# EAGLE design ValveModule_r2 (EAGLE 7.7.0)
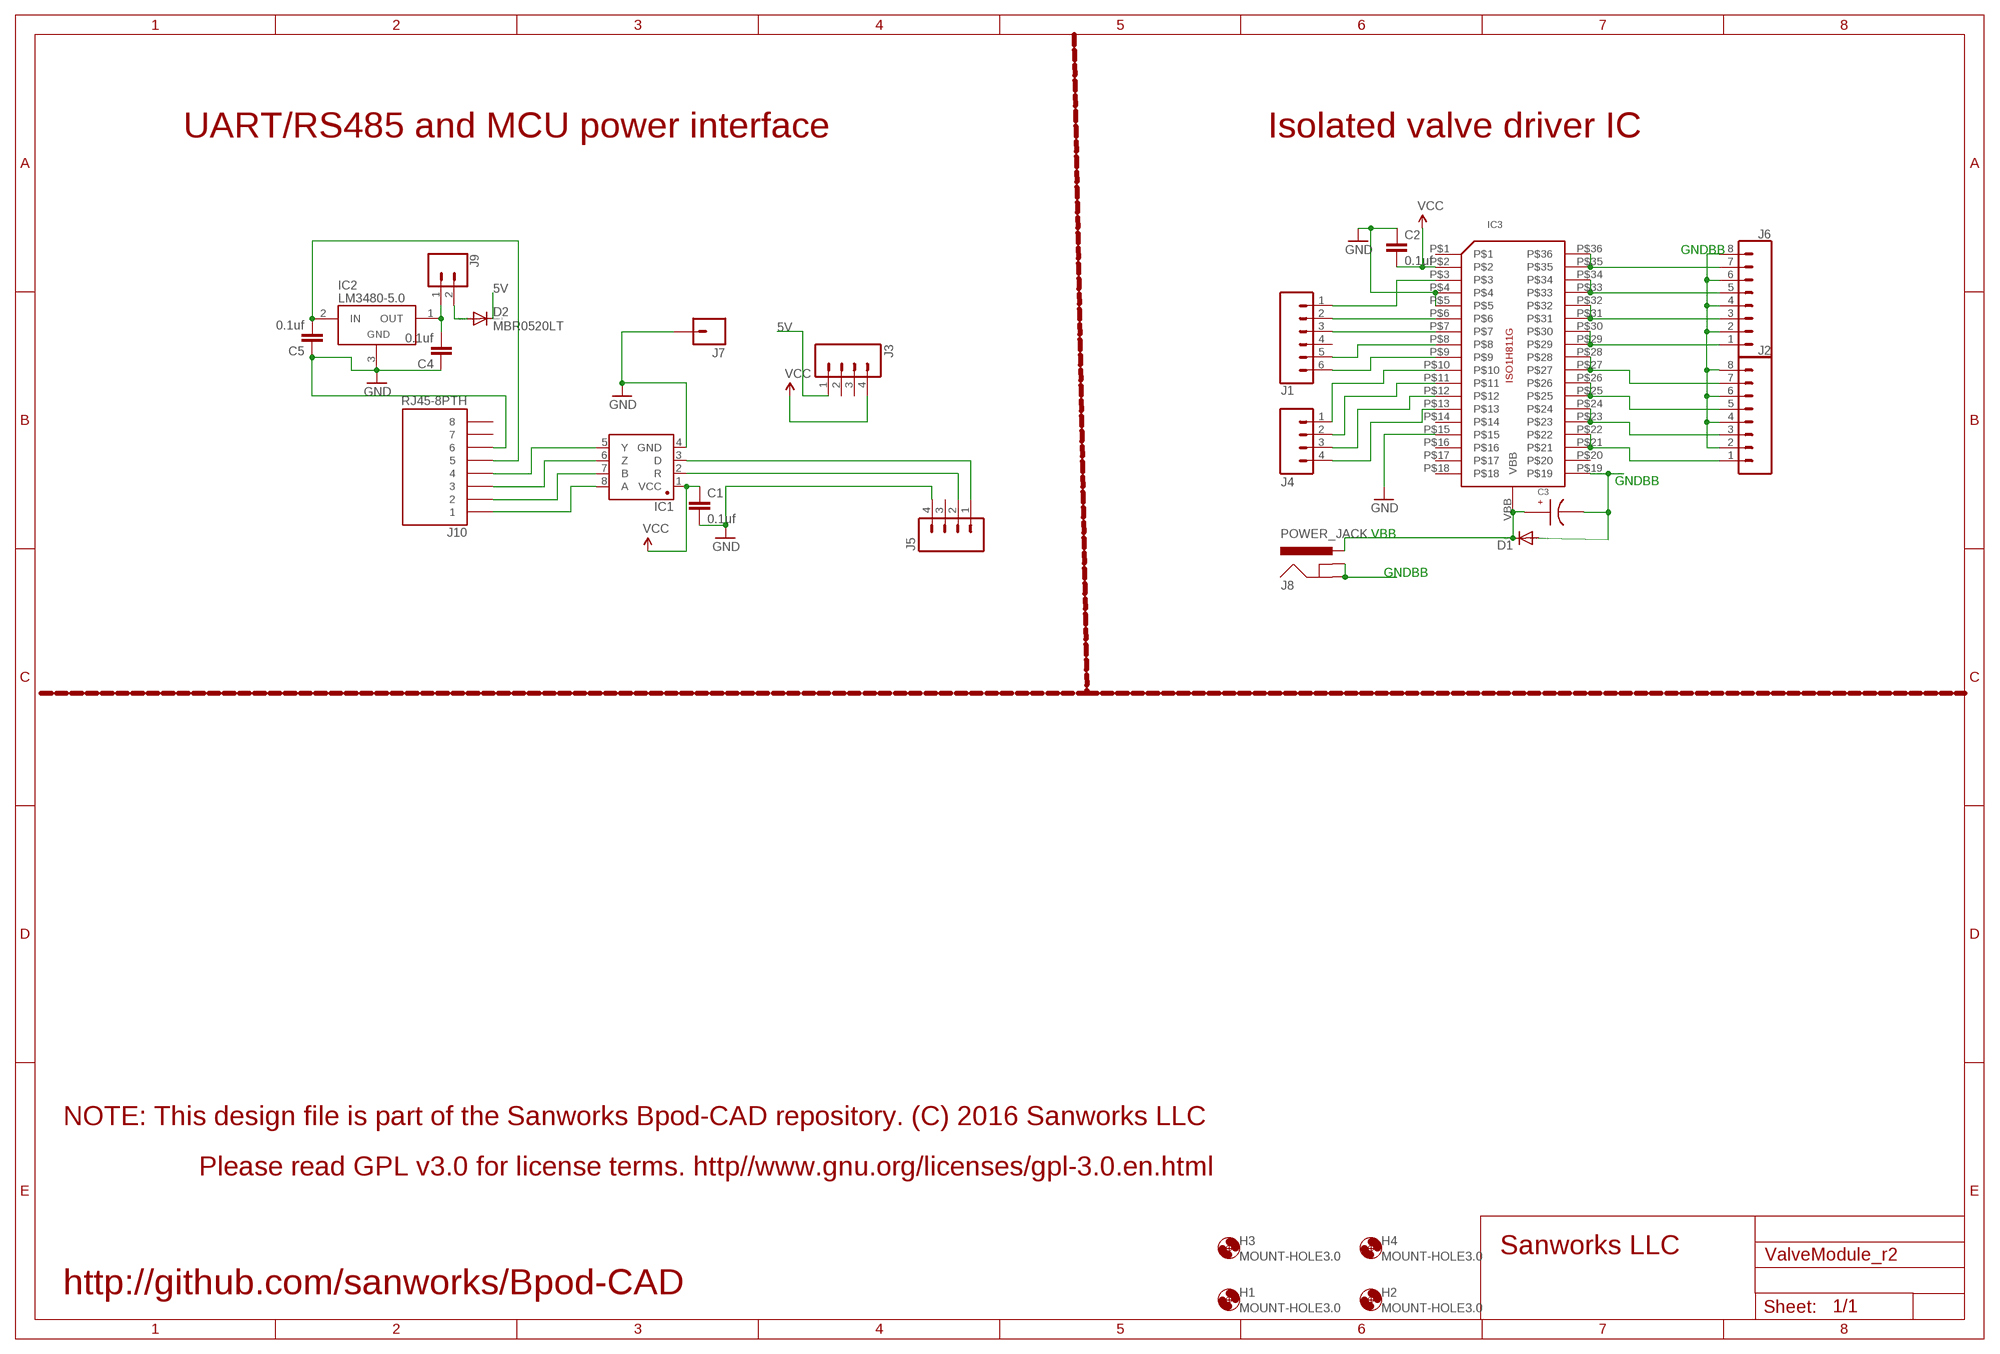
[diagram p0: schematic, sheet 1]

## Parts
C1  0.1uf  CAP1206  [1206]
C2  0.1uf  CAP1206  [1206]
C3  EEE-FK1H100UR  [EEE-FK1H100UR]
C4  0.1uf  CAP1206  [1206]
C5  0.1uf  CAP1206  [1206]
D1  DIODE-DO214AA  [DO214AA]
D2  MBR0520LT  [SOD123]
H1  MOUNT-HOLE3.0  [3,0]
H2  MOUNT-HOLE3.0  [3,0]
H3  MOUNT-HOLE3.0  [3,0]
H4  MOUNT-HOLE3.0  [3,0]
IC1  SN65HVD31DR  [SO08]
IC2  LM3480-5.0  [SOT-23-3]
IC3  ISO1H811G  [ISO1H811G]
J1  CONN_06SILK_FEMALE_PTH  [1X06]
J2  CONN_083.5MM-8  [SCREWTERMINAL-3.5MM-8]
J3  M04PTH  [1X04]
J4  M04PTH  [1X04]
J5  M04PTH  [1X04]
J6  CONN_083.5MM-8  [SCREWTERMINAL-3.5MM-8]
J7  M01PTH  [1X01]
J8  POWER_JACK  [POWER_JACK_PTH]
J9  CONN_02  [1X02]
J10  RJ45-8PTH  [RJ45-8]

## Nets
5V: D2.C J3.1
GND: C1.2 C2.1 C4.1 C5.1 IC1.4(GND) IC2.3(GND) IC3.P$4 IC3.P$5 IC3.P$15 J5.4 J7.1 J10.6
GNDBB: C3.CATHODE D1.A IC3.P$19 J2.2 J2.4 J2.6 J2.8 J6.2 J6.4 J6.6 J6.8 J8.GND J8.GNDBREAK
N$1: IC3.P$35 IC3.P$36 J6.7
N$2: IC3.P$3 J1.1
N$3: IC3.P$6 J1.2
N$4: IC1.3(D) J5.1
N$5: IC3.P$7 J1.3
N$6: IC1.2(R) J5.2
N$7: IC1.8(A) J10.1
N$8: IC1.7(B) J10.2
N$9: IC1.6(Z) J10.3
N$10: IC1.5(Y) J10.4
N$11: IC3.P$8 J1.5
N$12: IC3.P$9 J1.6
N$13: IC3.P$10 J4.1
N$14: IC3.P$11 J4.2
N$15: IC3.P$12 J4.3
N$16: IC3.P$13 J4.4
N$17: IC3.P$33 IC3.P$34 J6.5
N$18: IC3.P$31 IC3.P$32 J6.3
N$19: IC3.P$29 IC3.P$30 J6.1
N$20: IC3.P$27 IC3.P$28 J2.7
N$21: IC3.P$25 IC3.P$26 J2.5
N$22: IC3.P$23 IC3.P$24 J2.3
N$23: IC3.P$21 IC3.P$22 J2.1
N$24: C5.2 IC2.2(IN) J10.5
N$25: C4.2 IC2.1(OUT) J9.1
N$26: D2.A J9.2
VBB: C3.ANODE D1.C IC3.VBB J8.PWR
VCC: C1.1 C2.2 IC1.1(VCC) IC3.P$2 J3.4
Unconnected: IC3.P$1 IC3.P$14 IC3.P$16 IC3.P$17 IC3.P$18 IC3.P$20 J1.4 J3.2 J3.3 J5.3 J10.7 J10.8

## Notes on the sheet
- UART/RS485 and MCU power interface | Isolated valve driver IC
- GNDBB
- 5V
- 5V
- GNDBB
- VBB
- GNDBB
- NOTE: This design file is part of the Sanworks Bpod-CAD repository. (C) 2016 Sanworks LLC
- Please read GPL v3.0 for license terms. http//www.gnu.org/licenses/gpl-3.0.en.html
- Sanworks LLC
- http://github.com/sanworks/Bpod-CAD

## Library data of the parts
C1 C2 C4 C5 = SparkFun-Capacitors:CAP: Capacitor Standard 0603 ceramic capacitor, and 0.1" leaded capacitor.
C3 = JoshParts10:EEE-FK1H100UR
D1 = diode:DIODE-: DIODE
D2 = diode:MBR0520LT: SCHOTTKY BARRIER RECTIFIER Source: http://onsemi.com .. MBR0520LT1-D.pdf
H1-H4 = holes:MOUNT-HOLE: MOUNTING HOLE with drill center marker
IC1 = Joshparts4:SN65HVD31DR: A placeholder for generic narrow & wide SOIC8 foorptints - used on the DIP adapter board.
IC2 = regulators:LM3480-*: National Semiconductor LM3480 100 mA, SOT-23, quasi-LDO linear regulator
IC3 = JoshParts10:ISO1H811G
J1 = SparkFun-Connectors:CONN_06: Multi connection point. Often used as Generic Header-pin footprint for 0.1 inch spaced/style header connections On any of the 0.1 inch spaced packages, you can populate with these: Break Away Headers - Straight <https://www.sparkfun.com/products/116> (PRT-00116) Break Away Male Headers - Right Angle <https://www.sparkfun.com/products/553> (PRT-00553) Female Headers <https://www.sparkfun.com/products/115> (PRT-00115) Break Away Headers - Machine Pin <https://www.sparkfun.com/products/117> (PRT-00117) Break Away Female Headers - Swiss Machine Pin <https://www.sparkfun.com/products/743> (PRT-00743) Arduino Stackable Header - 6 Pin <https://www.sparkfun.com/products/9280> (PRT-09280) For SCREWTERMINALS and SPRING TERMINALS visit here: Screw Terimnals on SparkFun.com <https://www.sparkfun.com/search/results?term=Screw+Terminals> (5mm/3.5mm/2.54mm spacing) This device is also useful as a general connection point to wire up your design to another part of your project. Our various solder wires solder well into these plated through hole pads. Hook-Up Wire - Assortment (Stranded, 22 AWG) <https://www.sparkfun.com/products/11375> (PRT-11375) Hook-Up Wire - Assortment (Solid Core, 22 AWG) <https://www.sparkfun.com/products/11367> (PRT-11367) View the entire wire category on our website here <https://www.sparkfun.com/categories/141>; PROD_ID: CONN-08437
J2 J6 = SparkFun-Connectors:CONN_08: Multi connection point. Often used as Generic Header-pin footprint for 0.1 inch spaced/style header connections On any of the 0.1 inch spaced packages, you can populate with these: Break Away Headers - Straight <https://www.sparkfun.com/products/116> (PRT-00116) Break Away Male Headers - Right Angle <https://www.sparkfun.com/products/553> (PRT-00553) Female Headers <https://www.sparkfun.com/products/115> (PRT-00115) Break Away Headers - Machine Pin <https://www.sparkfun.com/products/117> (PRT-00117) Break Away Female Headers - Swiss Machine Pin <https://www.sparkfun.com/products/743> (PRT-00743) Arduino Stackable Header - 8 Pin <https://www.sparkfun.com/products/9279> (PRT-09279) For SCREWTERMINALS and SPRING TERMINALS visit here: Screw Terimnals on SparkFun.com <https://www.sparkfun.com/search/results?term=Screw+Terminals> (5mm/3.5mm/2.54mm spacing) This device is also useful as a general connection point to wire up your design to another part of your project. Our various solder wires solder well into these plated through hole pads. Hook-Up Wire - Assortment (Stranded, 22 AWG) <https://www.sparkfun.com/products/11375> (PRT-11375) Hook-Up Wire - Assortment (Solid Core, 22 AWG) <https://www.sparkfun.com/products/11367> (PRT-11367) View the entire wire category on our website here <https://www.sparkfun.com/categories/141> Special notes: Molex polarized connector foot print use with SKU : PRT-08231 with associated crimp pins and housings. 1MM SMD Version SKU: PRT-10208 NOTES ON THE VARIANTS LOCK and LOCK_LONGPADS... This footprint was designed to help hold the alignment of a through-hole component (i.e. 6-pin header) while soldering it into place. You may notice that each hole has been shifted either up or down by 0.005 of an inch from it's more standard position (which is a perfectly straight line). This slight alteration caused the pins (the squares in the middle) to touch the edges of the holes. Because they are alternating, it causes a "brace" to hold the component in place. 0.005 has proven to be the perfect amount of "off-center" position when using our standard breakaway headers. Although looks a little odd when you look at the bare footprint, once you have a header in there, the alteration is very hard to notice. Also,if you push a header all the way into place, it is covered up entirely on the bottom side.
J3-J5 = SparkFun-Connectors:M04: Header 4 Standard 4-pin 0.1" header. Use with straight break away headers (SKU : PRT-00116), right angle break away headers (PRT-00553), swiss pins (PRT-00743), machine pins (PRT-00117), and female headers (PRT-00115). Molex polarized connector foot print use with SKU : PRT-08231 with associated crimp pins and housings. 1MM SMD Version SKU: PRT-10208; PROD_ID: CONN-09696
J7 = SparkFun-Connectors:M01: Header 1 Standard 1-pin 0.1" header. Use with straight break away headers (SKU : PRT-00116), right angle break away headers (PRT-00553), swiss pins (PRT-00743), machine pins (PRT-00117), and female headers (PRT-00115). SMTSO-256-ET is a "flush mount" nut for a 4-40 screw. The older package used to be too tight, and did not allow it to sit properly thru the drill hit. The latest (0.165DIA) fits nice and snug.
J8 = SparkFun-Connectors:POWER_JACK: Power Jack Connector This is the standard 5.5mm barrel jack for power. The PTH is the most common, proven, reliable, footprint. The Slot footprint only works if the mill layer is transmitted to the PCB fab house so be warned. Here are the connectors we sell at SparkFun: DC Barrel Power Jack/Connector <https://www.sparkfun.com/products/119> (PRT-00119) DC Barrel Power Jack/Connector (SMD) <https://www.sparkfun.com/products/12748> (PRT-12748) DC Barrel Jack Adapter - Breadboard Compatible <https://www.sparkfun.com/products/10811> (PRT-10811) It is used on this SparkFun product (and many, many others): SparkFun RedBoard - Programmed with Arduino <https://www.sparkfun.com/products/12757> (DEV-12757) Also, if you need a mating power supply or connector, please check these out: Wall Adapter Power Supply - 9VDC 650mA <https://www.sparkfun.com/products/298> (TOL-00298) DC Barrel Jack Adapter - Male <https://www.sparkfun.com/products/10287> (PRT-10287); PROD_ID: CONN-08197
J9 = SparkFun-Connectors:CONN_02: Multi connection point. Often used as Generic Header-pin footprint for 0.1 inch spaced/style header connections On any of the 0.1 inch spaced packages, you can populate with these: Break Away Headers - Straight <https://www.sparkfun.com/products/116> (PRT-00116) Break Away Male Headers - Right Angle <https://www.sparkfun.com/products/553> (PRT-00553) Female Headers <https://www.sparkfun.com/products/115> (PRT-00115) Break Away Headers - Machine Pin <https://www.sparkfun.com/products/117> (PRT-00117) Break Away Female Headers - Swiss Machine Pin <https://www.sparkfun.com/products/743> (PRT-00743) For SCREWTERMINALS and SPRING TERMINALS visit here: Screw Terimnals on SparkFun.com <https://www.sparkfun.com/search/results?term=Screw+Terminals> (5mm/3.5mm/2.54mm spacing) This device is also useful as a general connection point to wire up your design to another part of your project. Our various solder wires solder well into these plated through hole pads. Hook-Up Wire - Assortment (Stranded, 22 AWG) <https://www.sparkfun.com/products/11375> (PRT-11375) Hook-Up Wire - Assortment (Solid Core, 22 AWG) <https://www.sparkfun.com/products/11367> (PRT-11367) View the entire wire category on our website here <https://www.sparkfun.com/categories/141> Special notes: Molex polarized connector foot print use with: PRT-08233 with associated crimp pins and housings. 2.54_SCREWTERM for use with PRT-10571. 3.5mm Screw Terminal footprints for PRT-08084 5mm Screw Terminal footprints for use with PRT-08432
J10 = SparkFun:RJ45-8: RJ45 Jack Simple RJ45, 8-pin connection - connector for common Cat5, Cat5e, and Cat6 Ethernet cables. Footprint not yet proven in production. Connector sku is PRT-00643; Breakout PCB sku is BOB-00716.

## Board
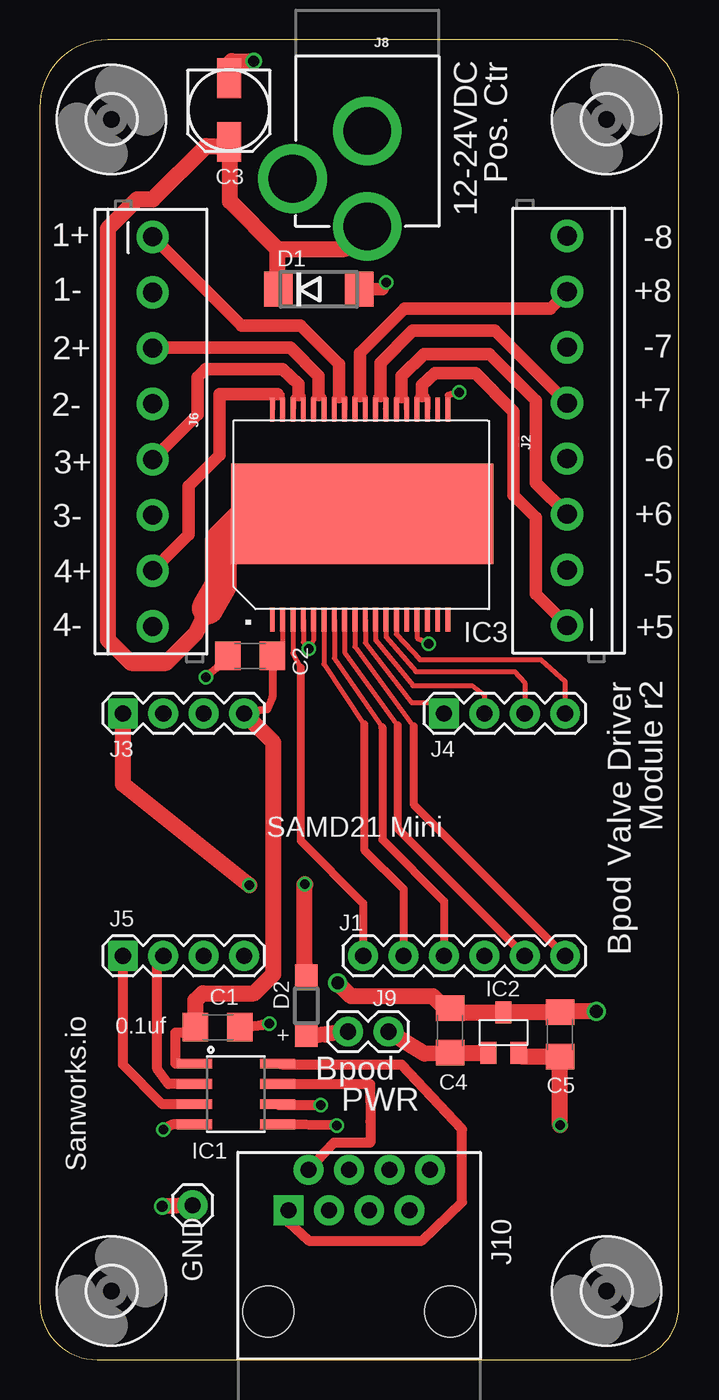
[diagram p1: board, top side]
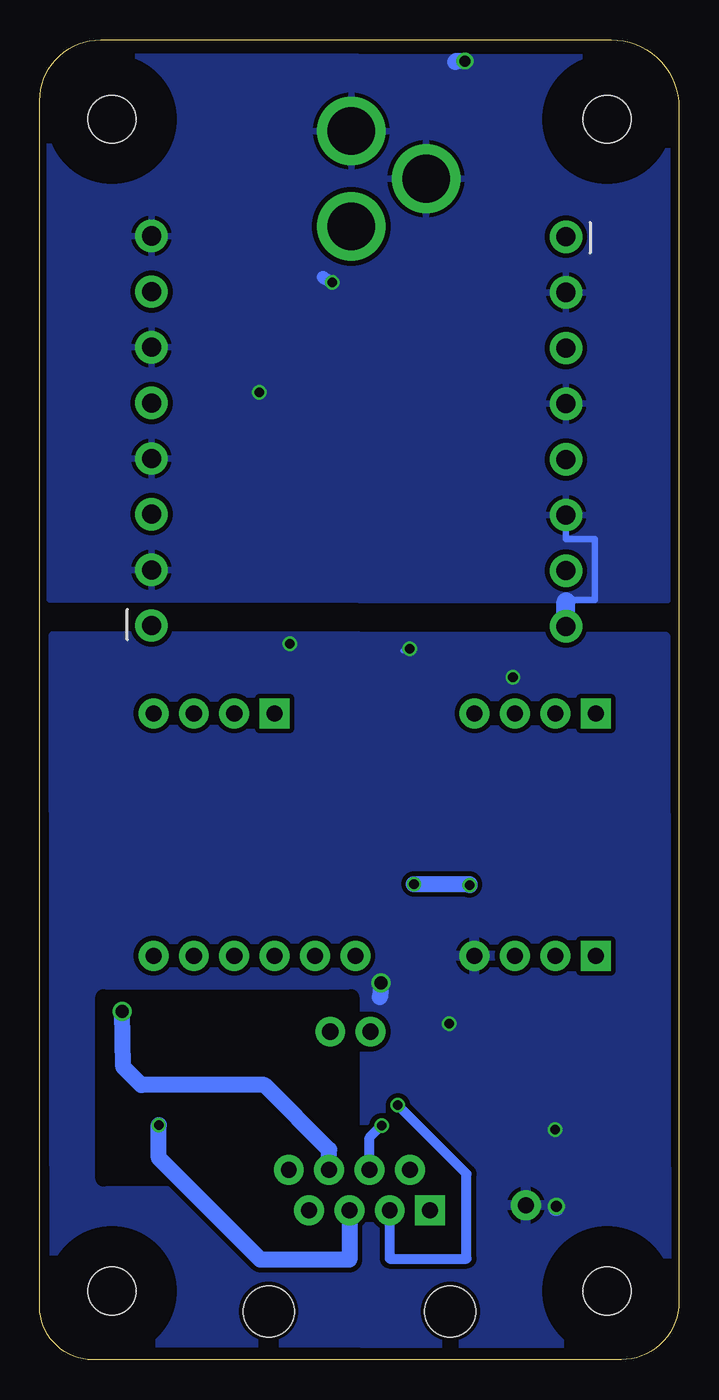
[diagram p2: board, bottom side, seen from below]

Size 40.2 x 83 mm. Coordinates in mm from the lower left corner, seen from the top.
Outline: 0,78.74 0,3.63 arc90 3.63,0 36.87,0 arc90 40.2,3.33 40.2,79.17 arc90 36.38,83 4.26,83 arc90 0,78.74
Copper layers (1*16): Top 0.035mm / dielectric 1.5mm / Bottom 0.035mm
Design rules "SeeedStudio_2layer_DRU_no_angle_20140221 *": minimum track width 6mil, minimum drill 12mil, track to track 12mil, track to pad 12mil, pad to pad 12mil, via to via 6mil, smd to smd 0mil, copper to edge 10mil, drill to drill 10mil, minimum pad ring 10mil, minimum via ring 6mil, stop-mask expansion 2mil, vias tented up to drill 100mil, thermal gap 10mil
bRestrict: area 20.6,11.4 to 36.2,22.8

### Footprints (pad centres in the part's own frame; a part is rotated, then mirrored left to right if it is on the bottom)
1206 = smd 1.6 x 1.8: 1 -1.4,0; 2 1.4,0
EEE-FK1H100UR = smd 1.5 x 2.5: ANODE 0,4; CATHODE 0,0
DO214AA = smd 1.8 x 2.2: A 2.55,0; C -2.55,0
SOD123 = smd 1.4 x 1.4: A 1.9,0; C -1.9,0
3,0 = hole 3: 0,0
SO08 = smd 0.61 x 2.21: 1 -1.905,-2.616; 2 -0.635,-2.616; 3 0.635,-2.616; 4 1.905,-2.616; 5 1.905,2.616; 6 0.635,2.616; 7 -0.635,2.616; 8 -1.905,2.616
SOT-23-3 = smd 1.016 x 1.397: 1 -0.953,-1.27; 2 0.953,-1.27; 3 0,1.27
ISO1H811G = smd 1.5 x 0.305: P$1 0,11.05; P$2 0,10.4; P$3 0,9.75; P$4 0,9.1; P$5 0,8.45; P$6 0,7.8; P$7 0,7.15; P$8 0,6.5; P$9 0,5.85; P$10 0,5.2; P$11 0,4.55; P$12 0,3.9; P$13 0,3.25; P$14 0,2.6; P$15 0,1.95; P$16 0,1.3; P$17 0,0.65; P$18 0,0; P$19 13.2,0; P$20 13.2,0.65; P$21 13.2,1.3; P$22 13.2,1.95; P$23 13.2,2.6; P$24 13.2,3.25; P$25 13.2,3.9; P$26 13.2,4.55; P$27 13.2,5.2; P$28 13.2,5.85; P$29 13.2,6.5; P$30 13.2,7.15; P$31 13.2,7.8; P$32 13.2,8.45; P$33 13.2,9.1; P$34 13.2,9.75; P$35 13.2,10.4; P$36 13.2,11.05 | smd 6.3 x 16.51: VBB 6.65,5.4
1X06 = drill 1.016 pad 1.88: 1 0,0; 2 2.54,0; 3 5.08,0; 4 7.62,0; 5 10.16,0; 6 12.7,0
SCREWTERMINAL-3.5MM-8 = drill 1.2 pad 2.032: 1 0,0; 2 3.5,0; 3 7,0; 4 10.5,0; 5 14,0; 6 17.5,0; 7 21,0; 8 24.5,0
1X04 = drill 1.016 pad 1.88 square: 1 0,0 | drill 1.016 pad 1.88: 2 2.54,0; 3 5.08,0; 4 7.62,0
1X01 = drill 1.016 pad 1.88: 1 0,0
POWER_JACK_PTH = drill 2.997 pad 4.318: GND 0,7.7; GNDBREAK 4.7,10.7; PWR 0,13.7
1X02 = drill 1.016 pad 1.88: 1 0,0; 2 2.54,0
RJ45-8 = drill 1 pad 1.88 square: 1 -4.445,6.35 | drill 1 pad 1.88: 2 -3.175,8.89; 3 -1.905,6.35; 4 -0.635,8.89; 5 0.635,6.35; 6 1.905,8.89; 7 3.175,6.35; 8 4.445,8.89 | hole 3.2: -5.715,0; 5.715,0

### Placement (x,y rotation side)
C1  11.2,20.91 0 top
C2  13.23,44.26 0 top
C3  11.9,80.58 180 top
C4  25.81,20.7 270 top
C5  32.73,20.45 270 top
D1  17.55,67.31 0 top
D2  16.76,22.26 270 top
H1  4.52,4.32 0 top
H2  35.66,4.32 0 top
H3  35.66,78 0 top
H4  4.52,78 0 top
IC1  12.34,16.71 270 top
IC2  29.17,20.57 0 top
IC3  25.68,46.55 90 top
J1  20.34,25.4 0 top
J2  33.17,46.16 90 top
J3  5.23,40.64 0 top
J4  25.43,40.64 0 top
J5  5.23,25.4 0 top
J6  7.1,70.61 270 top
J7  9.61,9.72 0 top
J8  20.6,84.96 180 top
J9  21.93,20.63 180 top
J10  20.09,3.05 0 top

### Tracks (layer width: path | path; a pad name or v marks a point on that pad's centre or on a via)
5V  (via drill 0.6)
  Top 1: v13.17,29.84 5.23,36.2 J3.1 | 16.7,29.87 v16.66,29.91 16.64,29.89 16.64,24.96 16.82,24.24 D2.C
  Bottom 1: v16.66,29.91 13.17,29.91 v13.17,29.84
GND  (via drill 0.6, 0.7, 0.8)
  Top 0.3: IC3.P$15 23.73,45.38 v24.47,45.02 | IC3.P$4 16.58,45.1 v16.92,44.7 17.23,45.27 IC3.P$5
  Top 0.5: C2.1 11.14,43.5 v10.44,42.93
  Top 0.635: IC1.4 8.35,14.8 v7.77,14.48 | C1.2 14.02,21.06 v14.44,21.14
  Top 1: v35.01,21.91 32.91,21.91 C5.1 29.49,21.85 IC2.3 26.06,21.84 C4.1 25.68,21.91 24.73,22.86 19.58,22.86 v18.74,23.7
  Top 1.016: J7.1 v7.71,9.65
  Bottom 0.3: v24.47,45.02 24.79,45.02 | v16.92,44.7 17.36,44.58
  Bottom 0.5: v10.44,42.93 10.44,42.74 10.38,42.8
  Bottom 1: J10.6 22,13.21 26.06,17.27 33.81,17.27 34.95,18.41 v35.01,21.91 | v18.74,23.7 18.8,22.8
  Bottom 1.016: v7.71,9.65 7.71,9.53
  pour Bottom: 0.79,1.02 39.27,1.08 39.33,45.53 0.85,45.47
GNDBB  (via drill 0.6, 0.7)
  Top 0.3: IC3.P$19 25.68,60.64
  Top 0.4: 25.68,60.64 v26.38,60.83
  Top 0.8: D1.A 21.55,67.31 v21.8,67.75
  Top 1: C3.CATHODE 11.9,81.48 12.08,81.66 v13.46,81.66
  Bottom 0.3: v26.38,60.83 26.31,60.77 26.25,60.83
  Bottom 0.406: 7.13,47.76 5.3,47.76 5.3,51.6 7.1,51.6 J6.6
  Bottom 0.8: 7.1,47.67 7.13,47.76 | v21.8,67.75 22.31,68.01 22.38,68.07
  Bottom 1: v13.46,81.66 14,81.66 14.06,81.6
  Bottom 1.2: J6.8 7.1,47.67
  pour Bottom: 0.72,81.92 0.72,47.75 39.59,47.82 39.59,81.98
N$1
  Top 0.3: IC3.P$35 15.27,59.74 15.27,60.71 14.95,60.71 14.63,60.71 | 14.63,60.71 IC3.P$36 14.63,60.71
  Top 0.8: 14.95,60.71 11.33,60.71 11.33,56.9 9.36,54.93 9.36,51.87 J6.7
N$2
  Top 0.3: IC3.P$3 15.93,44.42 16.41,43.52
  Top 0.5: 16.41,43.52 16.41,32.64 20.34,28.7 J1.1
N$3
  Top 0.3: IC3.P$6 17.88,43.74 20.41,39.95
  Top 0.5: 20.41,39.95 20.41,32.07 22.88,29.59 J1.2
N$4
  Top 0.635: IC1.3 7.7,16.07 5.23,18.54 J5.1
N$5
  Top 0.3: IC3.P$7 18.53,44.11 21.55,39.76
  Top 0.5: 21.55,39.76 21.55,32.7 25.43,28.83 J1.3
N$6
  Top 0.635: IC1.2 8.08,17.34 7.39,18.29 7.39,25.02 J5.2
N$7
  Top 0.635: J10.1 15.65,8.64 16.92,7.49 24.03,7.49 26.57,9.91 26.57,14.48 22.76,18.54 15.28,18.54 IC1.8
N$8
  Top 0.635: IC1.7 20.78,17.34 20.79,14.99 20.79,13.65 18.5,13.65 J10.2
N$9  (via drill 0.6)
  Top 0.635: v17.68,16 15.02,16 IC1.6
  Bottom 0.635: J10.3 18.19,6.35 13.36,6.35 13.36,11.68 v17.68,16
N$10  (via drill 0.6)
  Top 0.635: v18.69,14.73 IC1.5
  Bottom 0.635: J10.4 19.46,13.97 v18.69,14.73
N$11
  Top 0.3: IC3.P$8 19.18,44.47 22.5,39.89
  Top 0.5: 22.5,39.89 22.5,33.4 J1.5
N$12
  Top 0.3: IC3.P$9 19.83,44.84 23.52,39.83
  Top 0.5: 23.52,39.83 23.52,34.92 J1.6
N$13
  Top 0.3: IC3.P$10 20.48,45.08 23.4,41.32 24.98,41.32 25.31,41.17 25.55,40.77 J4.1
N$14
  Top 0.3: IC3.P$11 21.13,45.25 23.46,42.38 27.2,42.38 27.96,41.8 J4.2
N$15
  Top 0.3: IC3.P$12 21.78,45.43 23.65,43.26 29.87,43.26 30.5,42.57 J4.3
N$16
  Top 0.3: IC3.P$13 22.43,45.61 23.9,44.02 31.52,44.02 33.05,42.67 J4.4
N$17
  Top 0.3: IC3.P$33 16.58,60.6 16.54,60.64 16.28,60.64 16.09,60.64 15.96,60.52 | 15.96,60.52 15.96,59.78 IC3.P$34 15.93,60.48 15.96,60.52
  Top 0.8: 16.28,60.64 16.28,61.34 15.27,62.29 10.44,62.29 9.93,61.78 9.93,59.44 J6.5
N$18
  Top 0.3: IC3.P$32 17.23,60.51 17.36,60.64 17.55,60.64 17.74,60.64 17.87,60.52 17.87,59.76 IC3.P$31
  Top 0.8: 17.55,60.64 17.55,61.85 15.77,63.63 7.12,63.63 J6.3
N$19
  Top 0.3: IC3.P$30 18.53,60.48 18.57,60.52 18.82,60.52 19.14,60.52 19.2,60.45 19.2,59.77 IC3.P$29
  Top 0.8: 18.82,60.52 18.82,62.61 16.41,65.02 12.69,65.02 J6.1
N$20
  Top 0.3: IC3.P$28 19.83,60.51 19.9,60.58 20.15,60.58 20.34,60.58 | 20.34,60.58 20.41,60.58 20.47,60.52 | 20.47,60.52 IC3.P$27 20.48,60.51 20.47,60.52 | 20.47,60.52 20.41,60.52 20.34,60.58
  Top 0.8: 20.15,60.58 20.15,63.31 22.95,66.1 32.11,66.1 J2.7 33.13,67.12
N$21
  Top 0.3: IC3.P$26 21.13,60.54 21.17,60.58 21.42,60.58 21.61,60.58 21.74,60.45 | 21.74,60.45 21.74,59.78 IC3.P$25 21.78,60.41 21.74,60.45
  Top 0.8: 21.42,60.58 21.42,62.67 23.46,64.71 28.63,64.71 J2.5
N$22
  Top 0.3: IC3.P$24 22.43,60.44 22.5,60.52 22.76,60.52 23.01,60.52 23.07,60.45 | 23.07,60.45 IC3.P$23 23.08,60.45 23.07,60.45
  Top 0.8: 22.76,60.52 22.76,61.85 24.15,63.25 28.28,63.25 31.2,60.33 31.2,55.13 J2.3
N$23
  Top 0.3: IC3.P$22 23.73,60.53 23.77,60.58 24.03,60.58 24.34,60.58 24.41,60.52 | 24.41,60.52 24.41,59.78 IC3.P$21 24.38,60.49 24.41,60.52
  Top 0.8: 24.03,60.58 24.03,61.28 24.85,62.04 27.39,62.04 29.81,59.63 29.81,54.36 31.2,52.96 31.2,48.13 J2.1
N$24  (via drill 0.6)
  Top 1: IC2.2 30.38,19.05 C5.2 v32.73,14.77 v32.72,14.76
  Bottom 1: J10.5 20.73,6.29 26.31,6.29 32.72,12.69 v32.72,14.76
N$25
  Top 1: J9.1 24.2,19.26 C4.2 IC2.1
N$26
  Top 1: J9.2 17.95,20.45 17.42,20.4 16.96,20.34 D2.A
VBB
  Top 0.8: 20.26,53.21 IC3.VBB | 14.95,67.55 D1.C
  Top 1: 10.57,47.24 9.8,45.66 7.96,43.81 5.74,43.81 4.28,45.28 4.28,71.12 6.12,72.96 7.1,72.96 10.46,76.32 11.96,76.32 | 14.96,69.84 11.96,72.84 11.96,76.32 | 11.96,76.32 11.96,76.52 C3.ANODE | 14.96,69.84 19.18,69.84 J8.PWR | 14.95,67.55 14.96,67.55 14.96,69.84
  Top 2: 10.57,47.24 11.39,48.7 11.39,51.5 13.17,53.28 20.2,53.28 | 20.2,53.28 27.52,53.28 | 20.2,53.28 IC3.VBB
  pour Top: 26.89,56.07 28.03,56.07 28.03,54.55 26.82,56.01
VCC
  Top 0.3: IC3.P$2 15.28,43.89 C2.2
  Top 0.5: C2.2 14.63,41.66 14.31,40.89 12.92,40.7 J3.4
  Top 0.635: IC1.1 8.53,18.61 8.53,20.57 9.8,20.57 C1.1
  Top 1: C1.1 9.8,22.6 10.25,23.05 13.49,23.05 14.69,24.26 14.69,38.8 J3.4

### Text on the board
tPlace: 12-24VDC | Pos. Ctr | -8 | 1+ | +8 | 1- | -7 | 2+ | +7 | 2- | -6 | 3+ | +6 | 3- | -5 | 4+ | +5 | 4- | IC3 | Bpod Valve Driver | Module r2 | SAMD21 Mini | Sanworks.io | 0.1uf | + | Bpod | PWR | J10 | GND